# Altium schematic sheet CPUWroom_Schem.SchDoc
size A3; SheetNumber: 1; SheetTotal: 2
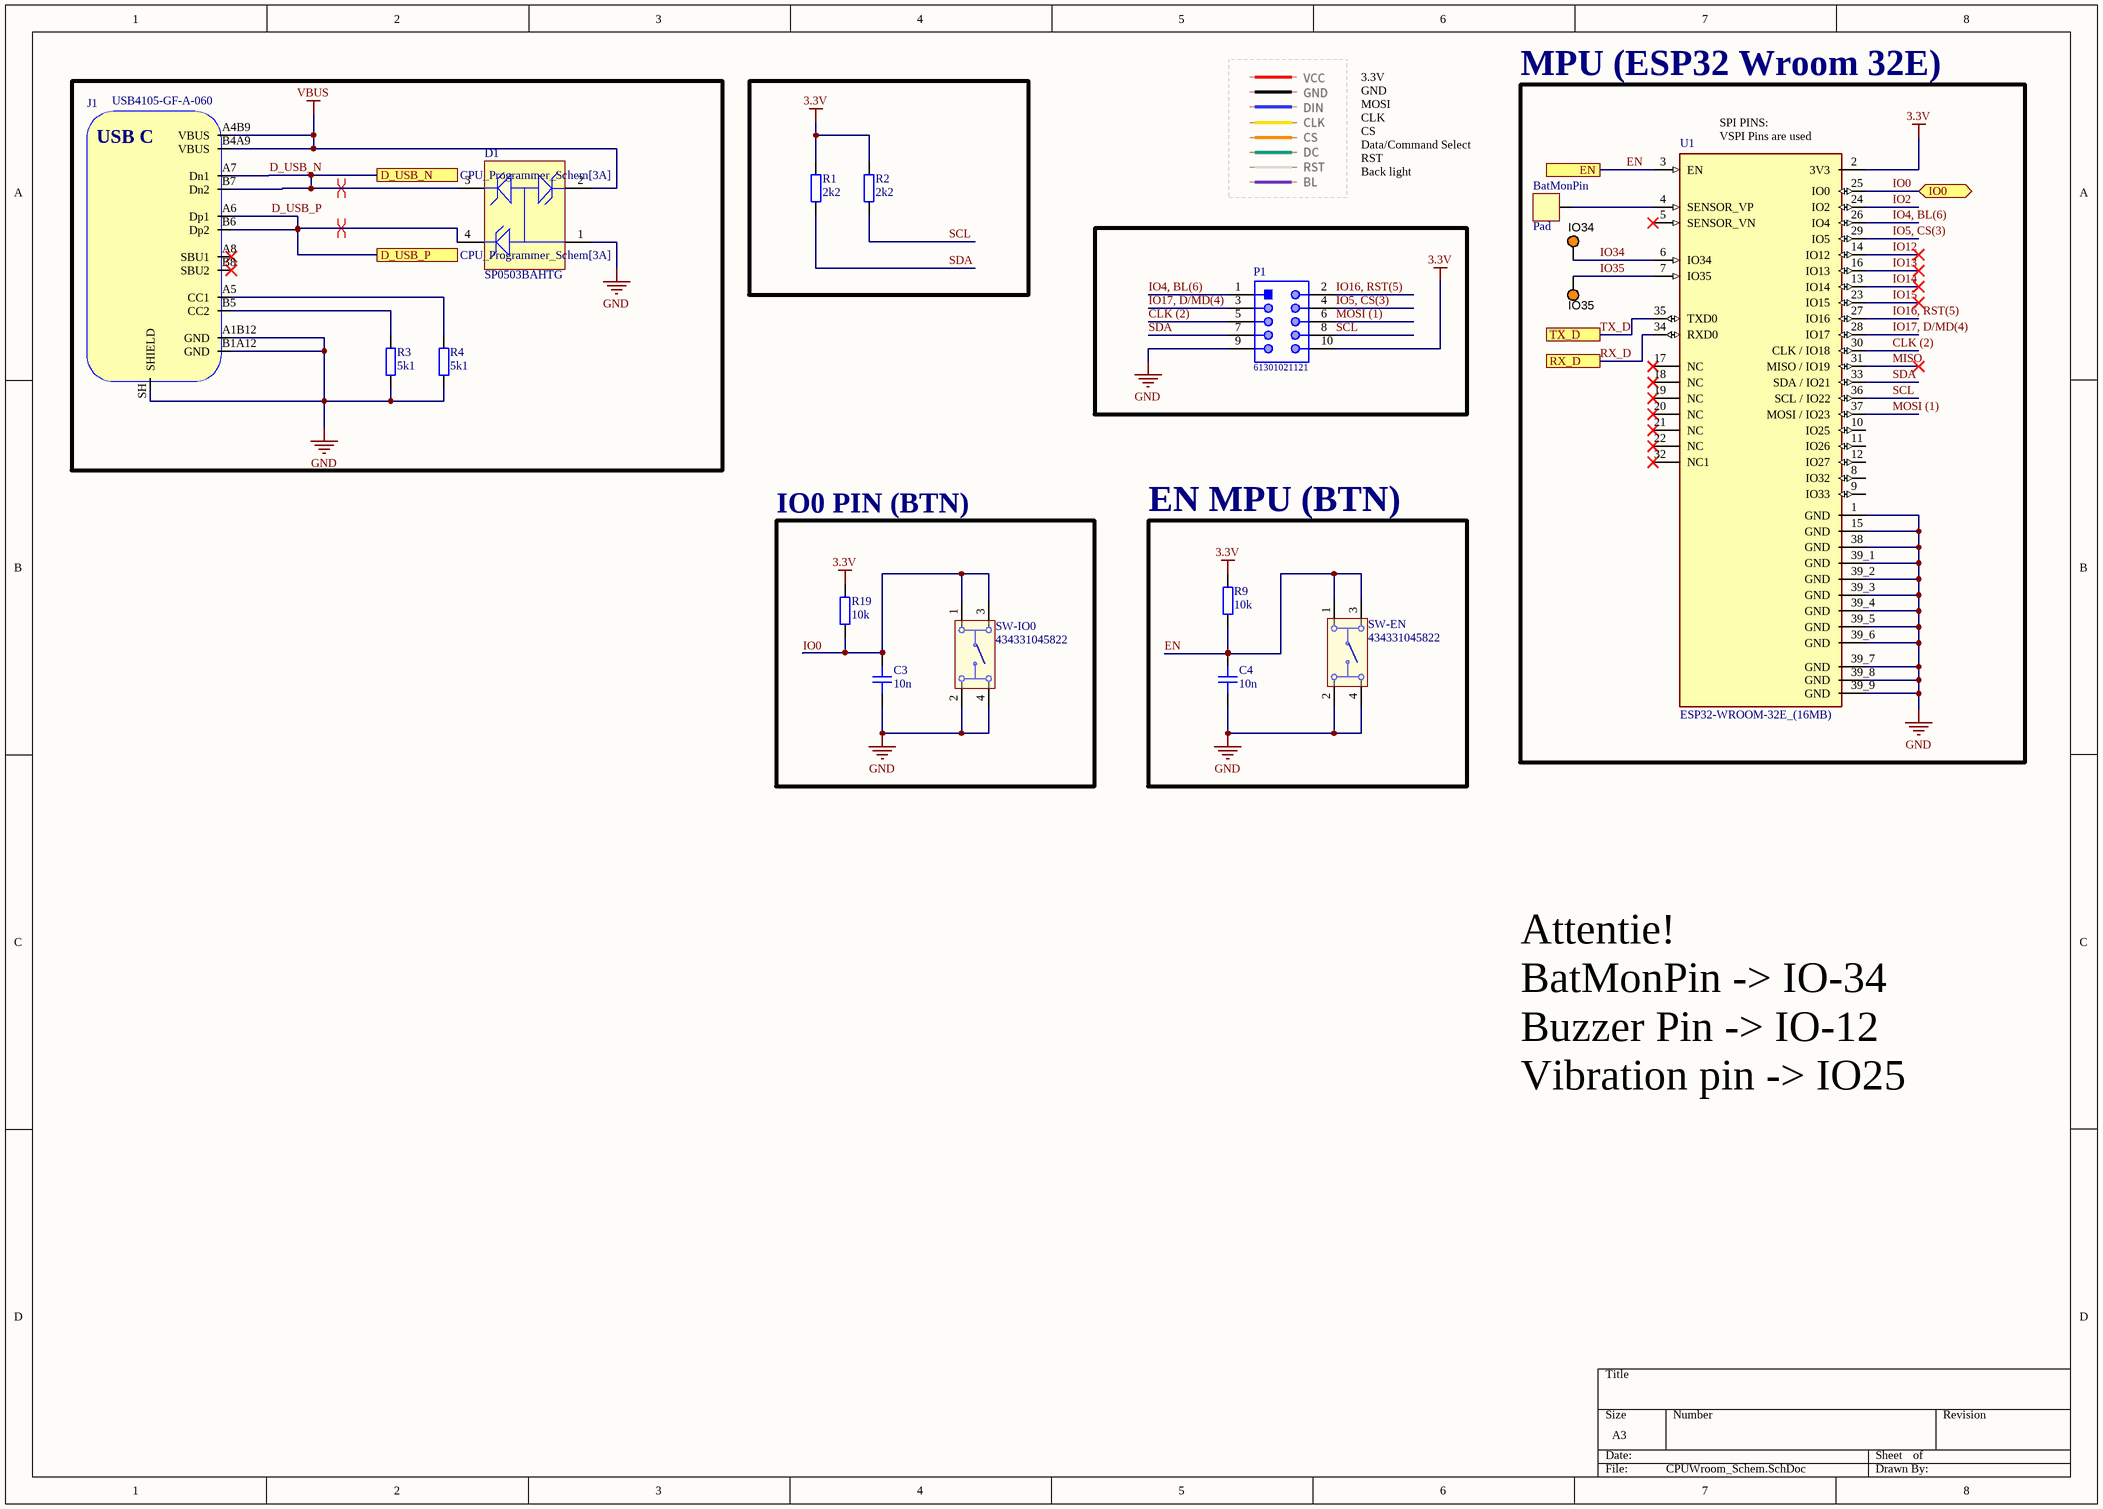
[diagram p0: CPUWroom_Schem.SchDoc]

## Parts
BatMonPin  Pad  [PAD_SQ_2MM]
C3  10n  [CAP_1206]
C4  10n  [CAP_1206]
D1  SP0503BAHTG  [LFUS-SOT143-4_V]
IO34  5003  [KSTN-5003]  (value not drawn)
IO35  5003  [KSTN-5003]  (value not drawn)
J1  USB4105-GF-A-060  [USB4105-GF-A-060]
P1  61301021121  [61301021121]
R1  2k2  [RES_1206]
R2  2k2  [RES_1206]
R3  5k1  [RES_1206]
R4  5k1  [RES_1206]
R9  10k  [RES_1206]
R19  10k  [RES_1206]
SW-EN  434331045822  [434331045822]
SW-IO0  434331045822  [434331045822]
U1  ESP32-WROOM-32E_(16MB)  [XCVR_ESP32-WROOM-32E_(16MB)]

## Blocks framed on the sheet
MPU (ESP32 Wroom 32E): BatMonPin IO34 IO35 U1
IO0 PIN (BTN): C3 R19 SW-IO0
EN MPU (BTN): C4 R9 SW-EN

## Ports
D_USB_N (see CPU_Programmer_Schem[3A]), D_USB_P (see CPU_Programmer_Schem[3A]), EN (see CPU_Programmer_Schem[6B]), IO0 (bidir, see CPU_Programmer_Schem[6A]), RX_D (see CPU_Programmer_Schem[1A], CPU_Programmer_Schem[4A]), TX_D (see CPU_Programmer_Schem[1A], CPU_Programmer_Schem[4A])

## Nets
3.3V: P1.10 R1.1 R2.1 R9.1 R19.1 U1.2(3V3)
GND: C3.1 C4.1 D1.1 J1.A1B12(GND) J1.B1A12(GND) J1.SH(SHIELD) P1.9 R3.1 R4.1 SW-EN.2 SW-EN.4 SW-IO0.2 SW-IO0.4 U1.1(GND) U1.15(GND) U1.38(GND) U1.39_1(GND) U1.39_2(GND) U1.39_3(GND) U1.39_4(GND) U1.39_5(GND) U1.39_6(GND) U1.39_7(GND) U1.39_8(GND) U1.39_9(GND)
VBUS: D1.2 J1.A4B9(VBUS) J1.B4A9(VBUS)
CLK (2): P1.5 U1.30(CLK_/_IO18)
D_USB_N: D1.3 J1.A7(Dn1) J1.B7(Dn2) ; port D_USB_N
D_USB_P: D1.4 J1.A6(Dp1) J1.B6(Dp2) ; port D_USB_P
EN: C4.2 R9.2 SW-EN.1 SW-EN.3 U1.3(EN) ; port EN
IO0: C3.2 R19.2 SW-IO0.1 SW-IO0.3 U1.25(IO0) ; port IO0
IO2: U1.24(IO2)
IO4, BL(6): P1.1 U1.26(IO4)
IO5, CS(3): P1.4 U1.29(IO5)
IO12: U1.14(IO12)
IO13: U1.16(IO13)
IO14: U1.13(IO14)
IO15: U1.23(IO15)
IO16, RST(5): P1.2 U1.27(IO16)
IO17, D/MD(4): P1.3 U1.28(IO17)
IO34: IO34.1 U1.6(IO34)
IO35: IO35.1 U1.7(IO35)
MISO: U1.31(MISO_/_IO19)
MOSI (1): P1.6 U1.37(MOSI_/_IO23)
RX_D: U1.34(RXD0) ; port RX_D
SCL: P1.8 R2.2 U1.36(SCL_/_IO22)
SDA: P1.7 R1.2 U1.33(SDA_/_IO21)
TX_D: U1.35(TXD0) ; port TX_D
NetBatMonPin_1: BatMonPin.1 U1.4(SENSOR_VP)
NetJ1_A5: J1.A5(CC1) R4.2
NetJ1_B5: J1.B5(CC2) R3.2

Not connected (* = marked no-connect by the designer): J1 A8(SBU1)* B8(SBU2)*; U1 5(SENSOR_VN)* 8(IO32) 9(IO33) 10(IO25) 11(IO26) 12(IO27) 17(NC)* 18(NC)* 19(NC)* 20(NC)* 21(NC)* 22(NC)* 32(NC1)*

## Layout directives
differential pair: D_USB_N, D_USB_P

## Notes on the sheet
- (near U1) SPI PINS:
  VSPI Pins are used
- 3.3V
  GND
  MOSI
  CLK
  CS
  Data/Command Select
  RST
  Back light
- Attentie!
  BatMonPin -> IO-34
  Buzzer Pin -> IO-12
  Vibration pin -> IO25
- (in symbol USB4105-GF-A-060) USB C

## Library data of the parts
BatMonPin = PAD_SQ_2MM: Test Point Square 2mm
C3 C4 = CAP_1206_50V: Capacitor SMD 1206 50V
D1 = CMP-2000-05191-1: TVS Diode Array, 30 pF, 30 KV, -40 to 85 degC, 4-Pin SOT143, RoHS, Tape and Reel; Manufacturer: Littelfuse; Direction Type: Uni-Directional; Product Height (mm): 1.05mm; Leakage Current (Max): 0.1uA; Clamping Voltage (Max): 8V; Reverse Stand-off Voltage: 5.5(Min)V; Configuration: Triple; Working Voltage: 5.5V; Product Length (mm): 3.04mm; Working Voltage (Max): 5.5V(Min); Capacitance Value: 30pF; Rad Hardened: No; Number of Elements: 3; Product Depth (mm): 1.4mm; Operating Temperature Max Deg. C: 85C; Suppressor Type: TVS; Operating Temperature Min Deg. C: -40C; Operating Temp Range: -40Cto85C; Mounting: SurfaceMount; Package / Case: SOT-143; Datasheet Version: Dec-13; Package Type: SOT-143; Packaging: TapeandReel; Pin Count: 3+Tab; Operating Temperature Classification: Industrial; Datasheet URL: https://datasheet.ciiva.com/15143/getdatasheetpartid-116020-15143550.pdf; Manufacturer URL: http://www.littelfuse.com/; Leakage Current: 0.1uA; Mounting Style: SurfaceMount; Clamping Voltage: 8V; Polarity: Uni-Directional
IO34 IO35 = CMP-002-00037-2: Test Point, Orange, Height 4.6 mm, Tail Length 3 mm, 1-Pin THD, RoHS; Manufacturer: Keystone; Colour: Orange; Packaging: Bulk; Package Description: 1-Pin Through Hole Device, Dia 2.54 mm; Pins: 1; Package Reference: 5003; Datasheet Version: Jun-15; Case/Package: 5003; Mounting Technology: TH; Connector Type: TestPoint; Diameter: 2.54mm; Contact Material: Bronze; Datasheet URL: http://keyelco.com/userAssets/file/M65p56.pdf; Manufacturer URL: http://www.keyelco.com/; Package Quantity: 10; Contact Plating: Tin; RoHS Compliant: True
J1 = USB4105-GF-A-060: USB Connector Type C SMT 12 Pin; Manufacturer: GCT; Manufacturer Part Number: USB4105-GF-A-060
P1 = CMP-1502-01084-1: THT Vertical Pin Header WR-PHD, Pitch 2.54 mm, Dual Row, 10 pins; Manufacturer: Wurth Elektronik; Working Voltage: 250VAC; Pitch: 2.54mm; Contact Resistance: 20mOhm; Gender: Male; Rated Current: 3A; Withstanding Voltage: 500VAC; Pin Number: 10; Operating Temperature: -40to105degC; Mounting Technology: THT; Publisher: WurthElektronik; Manufacturer URL: http://www.we-online.de; Part Number: 61301021121; Row Number: Dual; Packaging: Bag; Orientation: Vertical; Package Reference: 61301021121; Datasheet URL: https://katalog.we-online.de/em/datasheet/6130xx21121.pdf
R1-R4 R9 R19 = RES_1206: Resistor SMD 1206
SW-EN SW-IO0 = CMP-1461-00001-1: WS-TASU SMD Tact Switch 4.7X3.5 mm side push; Manufacturer: Wuerth Elektronik; NoPins: 04; ComponentLink1Description: Manufacturer URL; ComponentLink2Description: Datasheet; PartNumber: 434331045822; PackageReference: 434331045822; ComponentLink2URL: http://katalog.we-online.de/em/datasheet/434331045822.pdf; ComponentLink1URL: http://www.we-online.com
U1 = ESP32-WROOM-32E_(16MB): Bluetooth, WiFi 802.11b/g/n, Bluetooth v4.2 +EDR, Class 1, 2 and 3 Transceiver Module 2.4GHz ~ 2.5GHz Integrated, Trace Surface Mount; MP: ESP32-WROOM-32E (16MB); MF: Espressif Systems; Price: None; Availability: Not in stock; Package: None; Value: *; SnapEDA_Link: https://www.snapeda.com/parts/ESP32-WROOM-32E%20(16MB)/Espressif+Systems/view-part/?ref=snap; Check_prices: https://www.snapeda.com/parts/ESP32-WROOM-32E%20(16MB)/Espressif+Systems/view-part/?ref=eda